# Altium schematic sheet Modulo_de_apertura_Power.SchDoc: Modulo de apertura Power
size A4; Author: Agustin Dubuisson; SheetNumber: 1; SheetTotal: 4
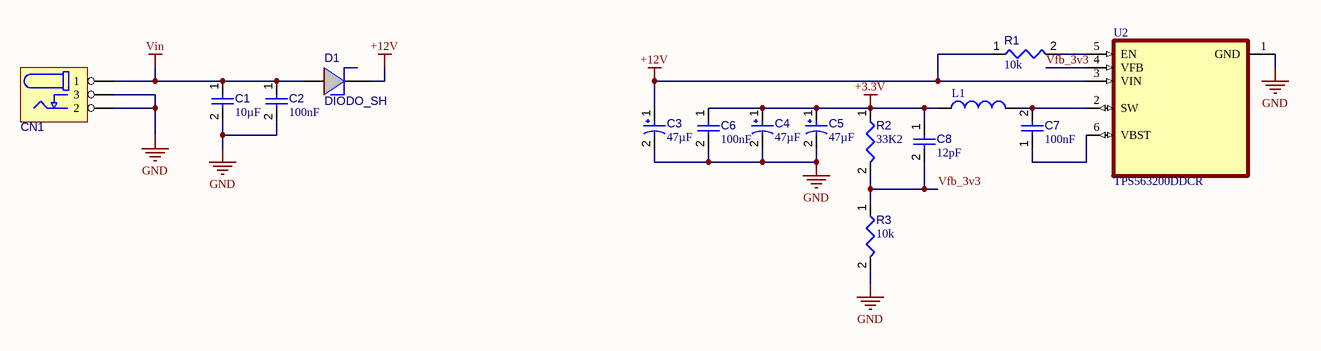
[diagram p0: Modulo_de_apertura_Power.SchDoc]

## Parts
C1  value 10µF  [CAPC0603(1608)100_L]  (hidden comment: Capacitor 10µF +/-20% 10V 0603)
C2  value 100nF  [CAPC0402(1005)60_L]  (hidden comment: Capacitor 100nF +/-20% 10V 0402)
C3  value 47µF  [CAPMP3217X18-T_V]  (hidden comment: TAJA105K035RNJ)
C4  value 47µF  [CAPMP3217X18-T_V]  (hidden comment: TAJA105K035RNJ)
C5  value 47µF  [CAPMP3217X18-T_V]  (hidden comment: TAJA105K035RNJ)
C6  value 100nF  [CAPC0402(1005)60_L]  (hidden comment: Capacitor 100nF +/-20% 50V 0402)
C7  value 100nF  [CAPC0402(1005)60_L]  (hidden comment: Capacitor 100nF +/-20% 10V 0402)
C8  value 12pF  [CAPC0402(1005)33_L]  (hidden comment: Capacitor 12pF +/-10% 50V 0402)
CN1  CN_PowerJack  [PJ002B]  (value not drawn)
D1  DIODO_SH  [D_SMA]
L1  IFSC1515AHER2R2M01  [FP-IFSC1515AH-MFG]  (value not drawn)
R1  value 10k  [RESC0402(1005)_L]  (hidden comment: Resistor 10K  +/-1 % 0402 63 mW)
R2  value 33K2  [RESC0402(1005)_L]  (hidden comment: Resistor 10K  +/-1 % 0402 63 mW)
R3  value 10k  [RESC0402(1005)_L]  (hidden comment: Resistor 10K  +/-1 % 0402 63 mW)
U2  TPS563200DDCR  [SOT23-6]

## Nets
+3.3V: C4.1 C5.1 C6.1 C8.1 L1.1 R2.1
+12V: C3.1 D1.2(K) R1.1 U2.3(VIN)
GND: C1.2 C2.2 C3.2 C4.2 C5.2 C6.2 CN1.2 CN1.3 R3.2 U2.1(GND)
Vin: C1.1 C2.1 CN1.1 D1.1(A)
Vfb_3v3: C8.2 R2.2 R3.1 U2.4(VFB)
NetC7_1: C7.1 U2.6(VBST)
NetC7_2: C7.2 L1.2 U2.2(SW)
NetR1_2: R1.2 U2.5(EN)

## Notes on the sheet
- Title:
- Size:
- Author:
- A4
- Sheet
- of
- Revision:
- File:
- Date:

## Library data of the parts
C1 = CMP-001-00075-4: Chip Capacitor, 10µF +/-20%, 10V, 0603, Thickness 1 mm; Tolerance: 10%; Voltage Rating: 10V; Max Operating Temperature: 85°C; Pins: 2; Case/Package: 0603; Mounting Technology: SMT; Min Operating Temperature: -55°C
C2 C7 = CMP-001-00061-3: Chip Capacitor, 100nF +/-20%, 10V, 0402, Thickness 0.6 mm; Tolerance: 20%; Mounting Technology: SMT; Voltage Rating: 10V; Max Operating Temperature: 85°C; Pins: 2; Case/Package: 0402; Min Operating Temperature: -55°C
C3-C5 = CMP-001-00040-7: Standard Tantalum, 1 uF, +/- 10%, 35 V, -55 to 125 degC, 1206 (3216 Metric), RoHS, Tape and Reel; Manufacturer: AVX; Voltage Rating: 35V; ESR: 7.5Ohm; Package Quantity: 2000; Case/Package: 1206; Datasheet Version: Feb-16; Tolerance: 10%; Max Operating Temperature: 125°C; Mounting Technology: SM; Package URL: http://www.avx.com/download/software/literature/AVX-Footprint-Library.pdf; Package Reference: CAPMP3217X18-T; Manufacturer URL: http://www.avx.com/; Min Operating Temperature: -55°C; Pins: 2; RoHS Compliant: True; Packaging: TapeandReel; Resistance: 7.5Ohm; Package Description: 2-Pin Surface Mount Device, Body 3.2 x 1.65 mm; Datasheet URL: http://datasheets.avx.com/TAJ.pdf; Capacitor Type: Tantalum
C6 = CMP-001-00067-3: Chip Capacitor, 100nF +/-20%, 50V, 0402, Thickness 0.6 mm; Tolerance: 10%; Min Operating Temperature: -55°C; Pins: 2; Case/Package: 0402; Max Operating Temperature: 85°C; Voltage Rating: 50V; Mounting Technology: SMT
C8 = CMP-001-00072-4: Chip Capacitor, 12pF +/-10%, 50V, 0402, Thickness 0.33 mm; Tolerance: 20%; Pins: 2; Max Operating Temperature: 85°C; Case/Package: 0402; Voltage Rating: 50V; Mounting Technology: SMT; Min Operating Temperature: -55°C
CN1 = CN_PowerJack: Barrel Power Connector
D1 = DIODO_SH: Diode Shottky
L1 = CMP-006-00026-1: General Purpose Inductor, 2.2uH, 20%, 1 Element, SMD, 1515; Max Current Rating: 3A; Max Operating Temperature: 125°C; Tolerance: 20%; RoHS Compliant: Yes; Pins: 2; Min Operating Temperature: -55°C
R1 R3 = CMP-009-00149-3: Chip Resistor, 10 kOhms, +/-1 %, 63 mW, -55 to 125 degC, 0402; Power: 63mW; Tolerance: 1%; Min Operating Temperature: -55°C; Case/Package: 0402; Max Operating Temperature: 155°C; Pins: 2
R2 = CMP-009-00149-3: Power: 63mW; Tolerance: 1%; Min Operating Temperature: -55°C; Case/Package: 0402; Max Operating Temperature: 155°C; Pins: 2
U2 = TPS563200DDCR: 17 V Input, 3A Synchronous Step-Down Regulator in SOT-23 with Advanced Eco-modeâ„¢; MF: Texas Instruments; SnapEDA_Link: https://www.snapeda.com/parts/TPS563200DDCR/Texas+Instruments/view-part/?ref=snap; Package: SOT-23-THN-6 Texas Instruments; Value: *; MP: TPS563200DDCR; Check_prices: https://www.snapeda.com/parts/TPS563200DDCR/Texas+Instruments/view-part/?ref=eda